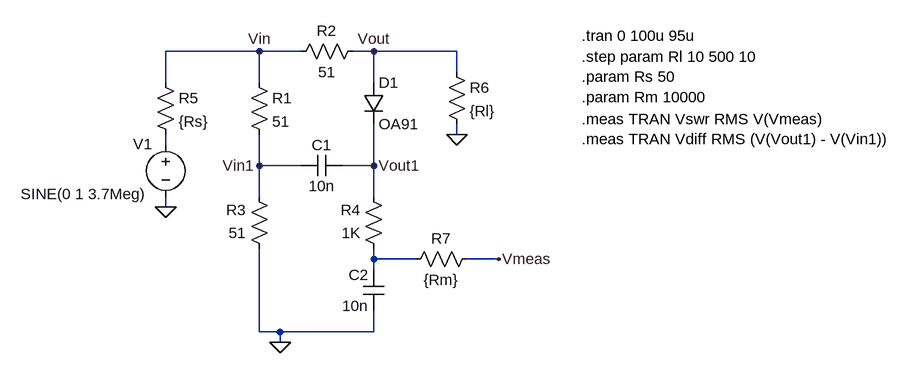
[diagram p0: schematic SWR Wheatstone Bridge 2.asc]
SWR Wheatstone Bridge 2.asc, the LTspice schematic file:
Version 4
SHEET 1 1560 680
WIRE 288 16 144 16
WIRE 352 16 288 16
WIRE 464 16 432 16
WIRE 592 16 464 16
WIRE 592 48 592 16
WIRE 144 64 144 16
WIRE 288 64 288 16
WIRE 464 64 464 16
WIRE 592 144 592 128
WIRE 144 160 144 144
WIRE 288 192 288 144
WIRE 352 192 288 192
WIRE 464 192 464 128
WIRE 464 192 416 192
WIRE 288 240 288 192
WIRE 464 240 464 192
WIRE 144 256 144 240
WIRE 464 336 464 320
WIRE 528 336 464 336
WIRE 656 336 608 336
WIRE 464 352 464 336
WIRE 288 448 288 320
WIRE 320 448 288 448
WIRE 464 448 464 416
WIRE 464 448 320 448
WIRE 320 464 320 448
FLAG 320 464 0
FLAG 144 256 0
FLAG 592 144 0
FLAG 656 336 Vmeas
FLAG 288 16 Vin
FLAG 464 16 Vout
FLAG 288 192 Vin1
FLAG 464 192 Vout1
SYMBOL res 272 48 R0
SYMATTR InstName R1
SYMATTR Value 51
SYMBOL res 448 0 R90
WINDOW 0 0 56 VBottom 2
WINDOW 3 32 56 VTop 2
SYMATTR InstName R2
SYMATTR Value 51
SYMBOL res 304 336 R180
WINDOW 0 36 76 Left 2
WINDOW 3 36 40 Left 2
SYMATTR InstName R3
SYMATTR Value 51
SYMBOL res 480 336 R180
WINDOW 0 36 76 Left 2
WINDOW 3 36 40 Left 2
SYMATTR InstName R4
SYMATTR Value 1K
SYMBOL cap 416 176 R90
WINDOW 0 0 32 VBottom 2
WINDOW 3 32 32 VTop 2
SYMATTR InstName C1
SYMATTR Value 10n
SYMBOL cap 480 416 R180
WINDOW 0 24 56 Left 2
WINDOW 3 24 8 Left 2
SYMATTR InstName C2
SYMATTR Value 10n
SYMBOL diode 448 64 R0
SYMATTR InstName D1
SYMATTR Value OA91
SYMBOL voltage 144 144 R0
WINDOW 0 -50 15 Left 2
WINDOW 3 -223 92 Left 2
WINDOW 123 0 0 Left 0
WINDOW 39 0 0 Left 0
SYMATTR InstName V1
SYMATTR Value SINE(0 1 3.7Meg)
SYMBOL res 128 48 R0
SYMATTR InstName R5
SYMATTR Value {Rs}
SYMBOL res 576 32 R0
SYMATTR InstName R6
SYMATTR Value {Rl}
SYMBOL res 624 320 R90
WINDOW 0 0 56 VBottom 2
WINDOW 3 32 56 VTop 2
SYMATTR InstName R7
SYMATTR Value {Rm}
TEXT 784 24 Left 2 !.step param Rl 10 500 10\n.param Rs 50\n.param Rm 10000
TEXT 784 -8 Left 2 !.tran 0 100u 95u
TEXT 784 120 Left 2 !.meas TRAN Vswr RMS V(Vmeas)\n.meas TRAN Vdiff RMS (V(Vout1) - V(Vin1))

The netlist it stands for:
* SWR Wheatstone Bridge 2.asc
R1 Vin Vin1 51
R2 Vout Vin 51
R3 0 Vin1 51
R4 N002 Vout1 1K
C1 Vout1 Vin1 10n
C2 0 N002 10n
D1 Vout Vout1 OA91
V1 N001 0 SINE(0 1 3.7Meg)
R5 Vin N001 {Rs}
R6 Vout 0 {Rl}
R7 Vmeas N002 {Rm}
.model D D
.lib standard.dio
.step param Rl 10 500 10
.param Rs 50
.param Rm 10000
.tran 0 100u 95u
.meas TRAN Vswr RMS V(Vmeas)
.meas TRAN Vdiff RMS (V(Vout1) - V(Vin1))
.backanno
.end